# EAGLE design thingy (EAGLE 9.2.2)
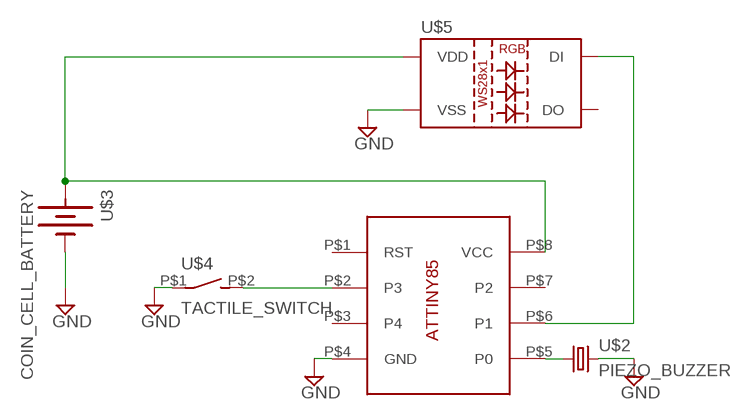
[diagram p0: schematic, sheet 1]

## Parts
U$1  ATTINY85-SOCKET  [DIP8SOCKET]
U$2  PIEZO_BUZZER  [PIEZO_BUZZER]
U$3  COIN_CELL_BATTERY  [COIN_BATTERY]
U$4  TACTILE_SWITCH  [TACTILE_SWITCH]
U$5  5MM-NEOPIXEL  [T1-3/4-LED]

## Nets
GND: U$1.P$4(GND) U$2.P$2 U$3.P$2(-) U$4.P$1(P) U$5.P$3(VSS)
N$2: U$1.P$8(VCC) U$3.P$1(+) U$5.P$2(VDD)
N$3: U$1.P$2(P3) U$4.P$2(S)
N$4: U$1.P$5(P0) U$2.P$1
N$6: U$1.P$6(P1) U$5.P$1(DI)
Unconnected: U$1.P$1(RST) U$1.P$3(P4) U$1.P$7(P2) U$5.P$4(DO)

## Library data of the parts
U$1 = MODEL2OBJECT:ATTINY85-SOCKET
U$2 = MODEL2OBJECT:PIEZO_BUZZER
U$3 = MODEL2OBJECT:COIN_CELL_BATTERY
U$4 = MODEL2OBJECT:TACTILE_SWITCH
U$5 = MODEL2OBJECT:5MM-NEOPIXEL

## Board
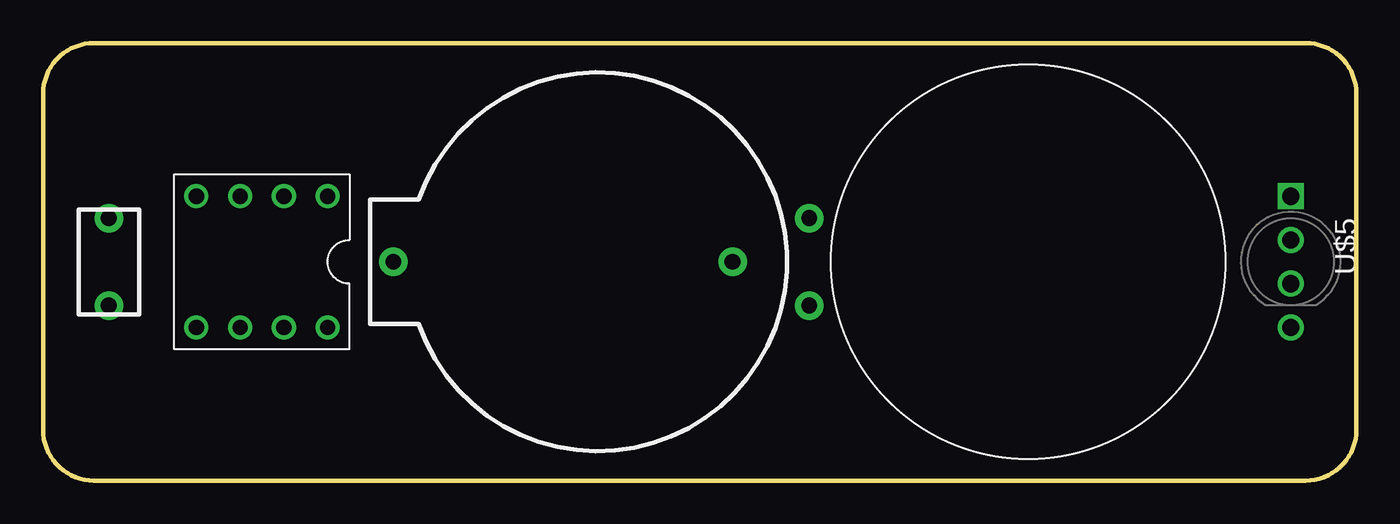
[diagram p1: board, top side]
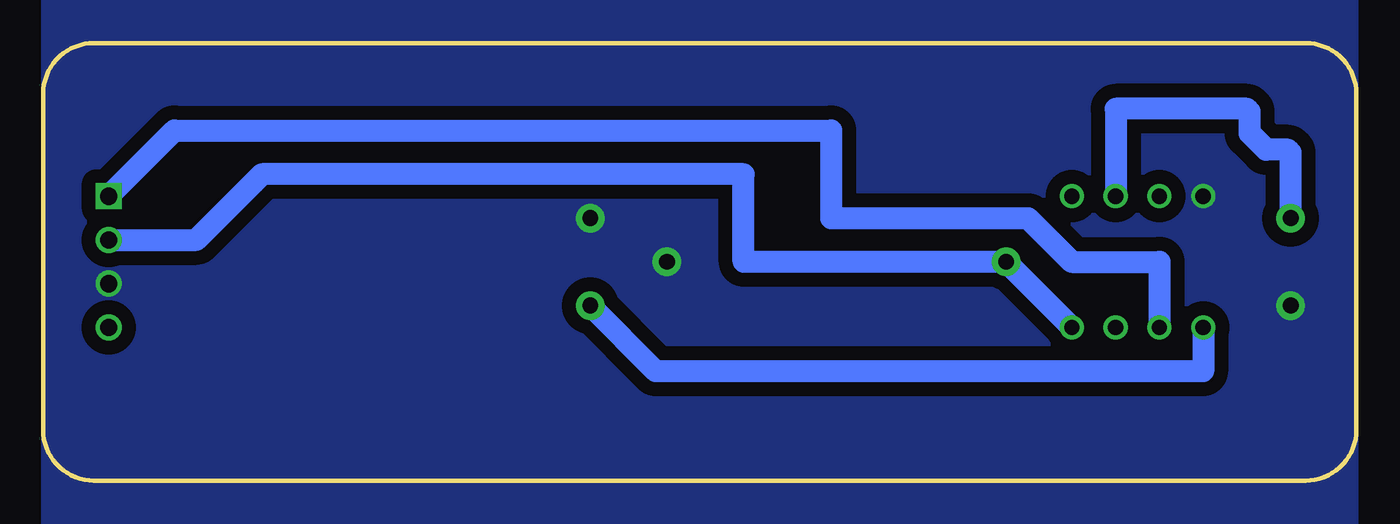
[diagram p2: board, bottom side, seen from below]

Size 76.2 x 25.4 mm. Coordinates in mm from the lower left corner, seen from the top.
Outline: 73.25,25.4 2.95,25.4 arc90 0,22.45 0,2.95 arc90 2.95,0 73.25,0 arc90 76.2,2.95 76.2,22.45 arc90 73.25,25.4
Copper layers (1*16): Top 0.035mm / dielectric 1.5mm / Bottom 0.035mm
Design rules "default *": minimum track width 6mil, minimum drill 0.35mm, track to track 6mil, track to pad 6mil, pad to pad 6mil, via to via 6mil, smd to smd 6mil, copper to edge 0mil, drill to drill 6mil, minimum pad ring 10mil, minimum via ring 8mil, stop-mask expansion 4mil, vias tented up to drill 0mil, thermal gap 10mil

### Footprints (pad centres in the part's own frame; a part is rotated, then mirrored left to right if it is on the bottom)
DIP8SOCKET = drill 0.889: P$1 0,0; P$2 0,-2.54; P$3 0,-5.08; P$4 0,-7.62; P$5 7.62,-7.62; P$6 7.62,-5.08; P$7 7.62,-2.54; P$8 7.62,0
PIEZO_BUZZER = drill 0.914 pad 1.651: P$1 -2.54,12.7; P$2 2.54,12.7
COIN_BATTERY = drill 0.914 pad 1.651: P$1 0,0; P$2 0,-19.685
TACTILE_SWITCH = drill 0.914 pad 1.651: P$1 0,0; P$2 0,-5.08
T1-3/4-LED = drill 1 square: P$1 -3.81,0 | drill 1: P$2 -1.27,0; P$3 1.27,0; P$4 3.81,0

### Placement (x,y rotation side)
U$1  16.51,16.51 270 top
U$2  57.15,12.7 90 top
U$3  20.32,12.7 90 top
U$4  3.81,10.16 180 top
U$5  72.39,12.7 270 top

### Tracks (layer width: path | path; a pad name or v marks a point on that pad's centre or on a via)
GND
  pour Bottom (isolate 0.813, no thermals): 0,27.94 0,-2.54 76.2,-2.54 76.2,27.94
N$2
  Bottom 1.27: U$5.P$2 67.31,13.97 63.5,17.78 35.56,17.78 35.56,12.7 U$3.P$1 U$1.P$8
N$3
  Bottom 1.27: U$4.P$2 3.81,19.05 3.96,19.2 5.23,19.2 6.2,20.17 6.2,21.44 6.35,21.59 13.97,21.59 U$1.P$2
N$4
  Bottom 1.27: U$1.P$5 8.89,6.35 40.64,6.35 U$2.P$1
N$6
  Bottom 1.27: U$5.P$1 68.58,20.32 30.48,20.32 30.48,15.24 19.05,15.24 16.51,12.7 11.43,12.7 U$1.P$6